# Altium schematic sheet MCU.SchDoc
size A4; SheetNumber: 2; SheetTotal: 5
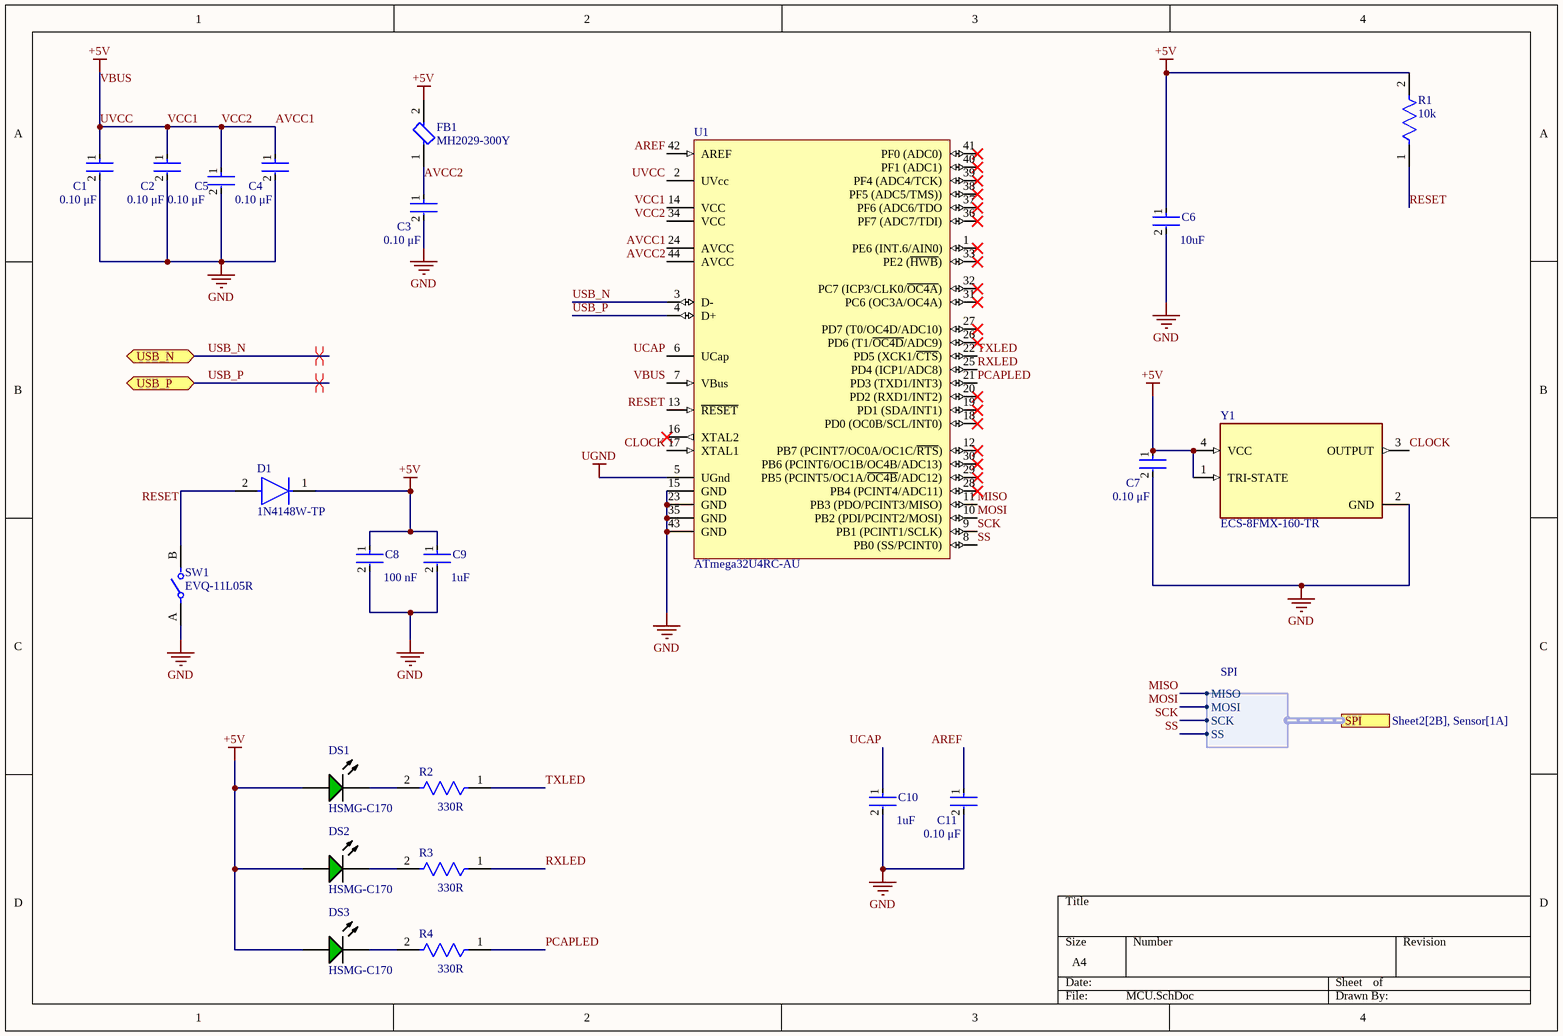
[diagram p0: MCU.SchDoc]

## Parts
C1  Capacitance: 0.10 μF  [FP-C0805C-DN-MFG]  (hidden comment: C0805C104J8RACTU)
C2  Capacitance: 0.10 μF  [FP-C0805C-DN-MFG]  (hidden comment: C0805C104J8RACTU)
C3  Capacitance: 0.10 μF  [FP-C0805C-DN-MFG]  (hidden comment: C0805C104J8RACTU)
C4  Capacitance: 0.10 μF  [FP-C0805C-DN-MFG]  (hidden comment: C0805C104J8RACTU)
C5  Capacitance: 0.10 μF  [FP-C0805C-DN-MFG]  (hidden comment: C0805C104J8RACTU)
C6  Capacitance: 10uF  [FP-C0805C-DG-MFG]  (hidden comment: C0805C106K8PACTU)
C7  Capacitance: 0.10 μF  [FP-C0805C-DN-MFG]  (hidden comment: C0805C104J8RACTU)
C8  Capacitance: 100 nF  [FP-CC0805-0_85-MFG]  (hidden comment: CC0805KRX7R7BB104)
C9  Capacitance: 1uF  [FP-C0805C-DG-MFG]  (hidden comment: C0805C106K8PACTU)
C10  Capacitance: 1uF  [FP-C0805C-DG-MFG]  (hidden comment: C0805C106K8PACTU)
C11  Capacitance: 0.10 μF  [FP-C0805C-DN-MFG]  (hidden comment: C0805C104J8RACTU)
D1  1N4148W-TP  [FP-SOD-123-IPC_A]
DS1  HSMG-C170  [AVAG-HSMX-C170_V]
DS2  HSMG-C170  [AVAG-HSMX-C170_V]
DS3  HSMG-C170  [AVAG-HSMX-C170_V]
FB1  MH2029-300Y  [FP-MH2029-MFG]
R1  Resistance: 10k  [FP-CRCW0805-e3-IPC_C]  (hidden comment: CRCW080522R0FKEA)
R2  Resistance: 330R  [FP-CR0805-IPC_B]  (hidden comment: 330 R)
R3  Resistance: 330R  [FP-CR0805-IPC_B]  (hidden comment: 330 R)
R4  Resistance: 330R  [FP-CR0805-IPC_B]  (hidden comment: 330 R)
SW1  EVQ-11L05R  [FP-EVQ-11L05R-MFG]
U1  ATmega32U4RC-AU  [44ML_N]
Y1  ECS-8FMX-160-TR  [OSC_ECS-8FMX-160-TR]

## Ports
SPI (harness SPI, see Sheet2[2B], Sensor[1A]), USB_N (bidir, see Sheet2[3B], USB[3B]), USB_P (bidir, see Sheet2[3B], USB[3B])

## Harnesses
SPI: MISO, MOSI, SCK, SS

## Nets
AVCC1: C1.1 C2.1 C4.1 C5.1 C6.1 C7.1 C8.1 C9.1 D1.1(C) DS1.1(A) DS2.1(A) DS3.1(A) FB1.2 R1.2 U1.2(UVcc) U1.7(VBus) U1.14(VCC) U1.24(AVCC) U1.34(VCC) Y1.1(TRI-STATE) Y1.4(VCC)  [also labelled +5V, UVCC, VBUS, VCC1, VCC2]
GND: C1.2 C2.2 C3.2 C4.2 C5.2 C6.2 C7.2 C8.2 C9.2 C10.2 C11.2 SW1.A U1.15(GND) U1.23(GND) U1.35(GND) U1.43(GND) Y1.2(GND)
UGND: U1.5(UGnd)
AREF: C11.1 U1.42(AREF)
AVCC2: C3.1 FB1.1 U1.44(AVCC)
CLOCK: U1.17(XTAL1) Y1.3(OUTPUT)
MISO: U1.11(PB3_(PDO/PCINT3/MISO)) ; port SPI.MISO
MOSI: U1.10(PB2_(PDI/PCINT2/MOSI)) ; port SPI.MOSI
PCAPLED: R4.1 U1.21(PD3_(TXD1/INT3))
RESET: D1.2(A) R1.1 SW1.B U1.13(~{RESET})
RXLED: R3.1 U1.25(PD4_(ICP1/ADC8))
SCK: U1.9(PB1_(PCINT1/SCLK)) ; port SPI.SCK
SS: U1.8(PB0_(SS/PCINT0)) ; port SPI.SS
TXLED: R2.1 U1.22(PD5_(XCK1/~{CTS}))
UCAP: C10.1 U1.6(UCap)
USB_N: U1.3(D-) ; port USB_N
USB_P: U1.4(D+) ; port USB_P
NetDS1_2: DS1.2(K) R2.2
NetDS2_2: DS2.2(K) R3.2
NetDS3_2: DS3.2(K) R4.2

Not connected (* = marked no-connect by the designer): U1 1(PE6_(INT.6/AIN0))* 12(PB7_(PCINT7/OC0A/OC1C/~{RTS}))* 16(XTAL2)* 18(PD0_(OC0B/SCL/INT0))* 19(PD1_(SDA/INT1))* 20(PD2_(RXD1/INT2))* 26(PD6_(T1/~{OC4D}/ADC9))* 27(PD7_(T0/OC4D/ADC10))* 28(PB4_(PCINT4/ADC11))* 29(PB5_(PCINT5/OC1A/~{OC4B}/ADC12))* 30(PB6_(PCINT6/OC1B/OC4B/ADC13))* 31(PC6_(OC3A/OC4A))* 32(PC7_(ICP3/CLK0/~{OC4A}))* 33(PE2_(~{HWB}))* 36(PF7_(ADC7/TDI))* 37(PF6_(ADC6/TDO)* 38(PF5_(ADC5/TMS)))* 39(PF4_(ADC4/TCK))* 40(PF1_(ADC1))* 41(PF0_(ADC0))*

## Layout directives
differential pair: USB_N, USB_P

## Library data of the parts
C1-C5 C7 C11 = CMP-03020-032188-1: CAP CER 0.1UF 10V 5% X7R 0805; Manufacturer: KEMET; Material: Ceramic; Tolerance: 0.05; Temperature Coefficient: 30ppm/°C; Value: 0.10 μF; Package: C0805C-DN; Device Class L1: Passive Components; Temperature: -55°C to +125°C; Category: Cap; RoHS: TRUE; Mouser Description: Multilayer Ceramic Capacitors MLCC - SMD/SMT 10volts 0.1uF X7R 5%; Lead Free: Yes; Temperature Range Low: -55°C; Temperature Range High: +125°C; Device Class L2: Capacitors; Temperature Characteristic: X7R; Device Class L3: Ceramic Capacitors; ComponentLink2Description: Datasheet; Automotive: No; Ipc Land Pattern Name: CAPC200125X78; Manufacturer Part Number: C0805C104J8RACTU; Voltage Rating: 10 V; Height: 0.88mm; Digikey Description: CAP CER 0.1UF 10V 5% X7R 0805; Octopart: https://octopart.com/c0805c104j8ractu-kemet-11807087; ComponentLink2URL: https://content.kemet.com/datasheets/KEM_C1003_C0G_SMD.pdf
C6 C9 C10 = CMP-2007-03243-2: CAP CER 10UF 10V X5R 0805; Manufacturer: Kemet; 3DS Part Number: 220-00001; Tolerance: 10%; Temperature Coefficient: 15%; Material: Ceramic; Device Class L2: Capacitors; Device Class L1: Passive Components; ComponentLink2URL: https://content.kemet.com/datasheets/KEM_C1006_X5R_SMD.pdf; Height: 1.4mm; Lead Free: Yes; Manufacturer Part Number: C0805C106K8PACTU; Digikey Description: CAP CER 10UF 10V X5R 0805; Octopart: https://octopart.com/c0805c106k8pactu-kemet-98697; Value: 10uF; Temperature Range Low: -55°C; Temperature: -55°C to +85°C; Automotive: No; Mouser Description: CAP CER 10UF 10V X5R 0805; Ipc Land Pattern Name: CAPC200125X125; Temperature Range High: +85°C; Voltage: 10V; RoHS: TRUE; Device Class L3: Ceramic Capacitors; ComponentLink2Description: Datasheet; Voltage Rating: 10V; Package: C0805C-DG; Temperature Characteristic: X5R; Category: Cap
C8 = CMP-1036-04402-6: CAP CER 0.1UF 16V X7R 0805; Manufacturer: Yageo; Material: Ceramic; Tolerance: 0.1; Value: 100 nF; Manufacturer Part Number: CC0805KRX7R7BB104; Temperature: -30°C to +85°C; Lead Free: Yes; Footprint Url: http://www.yageo.com/exep/pages/download/literatures/UPY-C_GEN_24.pdf; Voltage Rating: 16 V; Package: CC0805-0.85; RoHS: TRUE; Digikey Description: CAP CER 0.1UF 16V X7R 0805; Category: Cap; Octopart: https://octopart.com/cc0805krx7r7bb104-yageo-39467769; Device Class L3: Ceramic Capacitors; ComponentLink2URL: http://www.yageo.com/documents/recent/UPY-GPHC_Y5V_6.3V-to-50V_8.pdf; Temperature Range Low: -30°C; Mouser Description: Multilayer Ceramic Capacitors MLCC - SMD/SMT 100nF 16V X7R 10%; Automotive: No; Device Class L2: Capacitors; Height: 0.95mm; ComponentLink2Description: Datasheet; Temperature Characteristic: X7R; Ipc Land Pattern Name: CAPC200125X85; Device Class L1: Passive Components; Temperature Range High: +85°C
D1 = CMP-2000-04993-2: DIODE GEN PURP 100V 150MA SOD123; Max Reverse Leakage Current: 5uA; Max Surge Current: 2A; Reverse Recovery Time: 4ns; Polarity: Standard; Capacitance: 4pF; Max Forward Surge Current (Ifsm): 1A; Element Configuration: Single; Power Dissipation: 400mW; Forward Voltage: 1V; Radiation Hardening: No; Lead Free: Lead Free; Max Reverse Voltage (DC): 100V; Current Rating: 150mA; Forward Current: 150mA; Packaging: Tape and Reel; Number of Pins: 2; Package Quantity: 3000; Max Operating Temperature: 150°C; Min Operating Temperature: -65°C; Average Rectified Current: 150mA; Recovery Time: 4ns; Output Current: 150mA; Peak Non-Repetitive Surge Current: 2A; Width: 1.8mm; Voltage Rating (DC): 100V; Height: 1.2mm; Max Repetitive Reverse Voltage (Vrrm): 100V; Mount: Surface Mount; Length: 2.85mm
DS1-DS3 = CMP-2000-05062-1: Chip LED, Green, 2.2 V, -40 to 85 degC, 2-Pin SMD, Pb-Free, Tape and Reel; Manufacturer: Avago; No. of Pins: 2; Peak Wavelength: 570nm; SVHC: NoSVHC(16-Jun-2014); Dominant Wavelength: 572nm; Forward Current If: 20mA; Viewing Angle: 170deg; Lens Shape: Rectangular; PIV Max: 5V; External Width: 1.25mm; LED Type: Standard; External Depth: 0.8mm; Opto Mounting Orientation: Top; Luminous Intensity: 15mcd; Luminous Intensity Min: 4mcd; Forward Voltage VF Max: 2.6V; External Length / Height: 2mm; Bulb Size: 1.25mmx1.4mm; Light Area Height: 1mm; Voltage Vf Typ: 2.2V; Operating Temperature Max: 85degC; Datasheet Version: Oct-08; MSL: MSL2A-4weeks; Peak Forward Current: 20mA; Package Description: 2-Pin Surface Mount Device, Body 2 x 1.25 mm, Height 0.8 mm; Datasheet URL: https://datasheet.ciiva.com/29280/180495-da-01-en-chip-led-hsmg-c170-gelb-gruen-29280971.pdf; Storage Temperature Min: -40degC; LED Colour: Green; Wavelength Typ: 570nm; Mounting Type: SMD; Forward Current If Max: 20mA; Dominant Wavelength Typ: 572nm; LED Mounting: SMD; Operating Temperature Range: -30degCto+85degC; Operating Temperature Min: -30degC; Manufacturer URL: http://www.avagotech.com/; Packaging: CutTape; Luminous Intensity Typ: 15mcd; Package Reference: HSMX-C170; Storage Temperature Max: 85degC; Opto Case Style: SMD; Forward Voltage: 2.2V
FB1 = CMP-07252-000001-1: FERRITE BEAD 30 OHM 0805 1LN; Manufacturer: Bourns; Series Resistance: 25mΩ; Description: MH Series High Current Chip Ferrite Beads; Resistance: 30Ω; Value: 30Ω; Impedance At Frequency: 30Ω @ 100MHz; Rms Current: 3A; Tolerance: 25%; RoHS: TRUE; Manufacturer Part Number: MH2029-300Y; Temperature Range High: +125°C; Device Class L3: Ferrite Beads and Chips; Core Material: Ferrite; ComponentLink2Description: Datasheet; Category: FBead; Octopart: https://octopart.com/mh2029-300y-bourns-756929; Digikey Description: FERRITE BEAD 30 OHM 0805 1LN; Device Class L2: EMI / RFI Components; Lead Free: Yes; Mouser Description: Ferrite Beads 30 ohms 25% HIGH CURRENT; Automotive: No; Ipc Land Pattern Name: CAPC200120X90; Temperature: -55°C to +125°C; Device Class L1: Passive Components; Height: 1.1mm; ComponentLink2URL: https://www.bourns.com/docs/Product-Datasheets/mh.pdf; Package: MH2029; Temperature Range Low: -55°C
R1 = CMP-2001-03692-2: RES Thick Film, 22Ω, 1%, 0.125W, 100ppm/°C, 0805; Power Rating: 125mW; Voltage Rating: 150V; Case/Package: 0805; Radiation Hardening: No; Number of Terminations: 2; Termination: SMD/SMT; Package Quantity: 5000; Weight: 0.000194oz; Mount: Surface Mount; Lead Free: Lead Free; Height: 0.45mm; Composition: Thick Film; Min Operating Temperature: -55°C; Case Code (Metric): 2012; Temperature Coefficient: 100ppm/°C; Depth: 1.25mm; Packaging: Tape and Reel; Contact Plating: Tin; Width: 1.25mm; Case Code (Imperial): 0805; Length: 2mm; Max Operating Temperature: 155°C; Tolerance: 1%; Features: Automotive AEC-Q200; Military Standard: Not; Voltage Rating (DC): 150V; Max Power Dissipation: 125mW
R2-R4 = CMP-1013-00454-2: Thick Film Chip Resistors 0805 330Ω 0.125W 1% 100ppm/°C; Voltage Rating: 150V; Power Rating: 125mW; Case Code (Imperial): 0805; Packaging: Tape and Reel; REACH SVHC: No SVHC; Min Operating Temperature: -55°C; Height: 0.5mm; Tolerance: 1%; Radiation Hardening: No; Depth: 1.25mm; Mount: Surface Mount; Length: 2mm; Voltage Rating (DC): 150V; Contact Plating: Tin; Temperature Coefficient: 100ppm/°C; Thickness: 508um; Max Operating Temperature: 155°C; Termination: SMD/SMT; Military Standard: Not; Case Code (Metric): 2012; Width: 1.25mm; Package Quantity: 5000; Case/Package: 0805; Composition: Thick Film
SW1 = CMP-00287-55640044-1: EVQ-11L05R Switch Tactile N.O. SPST Round Button PC Pins 0.02A 15VDC 1.6N Thru-Hole Radial T/R; Max Current Rating: 20mA; Max Voltage Rating (DC): 15V; Mechanical Life: 100kcycles; Switch Function: Off-Mom; Switch Travel: 250µm; Number of Positions: 2; Actuator Length: 1.1mm; Illumination Type: Illuminated, Non-Illuminated; Contact Resistance: 50mΩ; Orientation: Straight; Max Operating Temperature: 70°C; Voltage Rating (DC): 15V; Length: 6mm; Electrical Life: 100kcycles; NexarPartId: 55640044; Termination: PC Pin; Height: 5mm; Radiation Hardening: No; Lead Free: Lead Free; Current Rating: 20mA; Mount: Through Hole; RoHS: Compliant; Operating Force: 1.6N; Contact Current Rating: 20mA; Throw Configuration: SPST; Life (Cycles): 100kcycles; REACH SVHC: Unknown; Min Operating Temperature: -20°C; Depth: 6mm; Case/Package: Radial
U1 = CMP-0095-00580-1: 8-bit AVR Microcontroller, 2.7-5.5V, 16MHz, 32KB Flash, 1KB EEPROM, 2.5KB SRAM, USB Controller, 44-pin TQFP, Industrial Grade (-40°C to 85°C), Int RC; PackageVersion: rev.G, Jul-2007; ComponentLink1URL: http://www.atmel.com/; ComponentLink2URL: http://www.atmel.com/dyn/resources/prod_documents/doc7766.pdf; PackageReference: 44ML; ComponentLink2Description: ATmega16U4/32U4 Datasheet; PackageDescription: 44-Pin Plastic Thin Quad Flat Pack, 10 x 10 x 1.0 mm Body, 0.8 mm Pitch (TQFP); ComponentLink3URL: http://www.atmel.com/dyn/resources/prod_documents/7766S.pdf; ComponentLink1Description: Manufacturer URL; DatasheetVersion: revF, Nov-2010; ComponentLink3Description: ATmega16U4 ATmega32U4 Summary
Y1 = CMP-009-000000-1: CMOS Oscillator Enable/Disable 4-SOJ, 5.08mm pitch; Component Type: Standard; Availability: Unavailable; Pin Count: 4; Price: None; Source: ECS-8FMX-160-TR.SchLib; Design Item ID: ECS-8FMX-160-TR; Value: *; MP: ECS-8FMX-160-TR; Package: None